# Altium schematic sheet Lidar_Robot_Power.SchDoc
size A
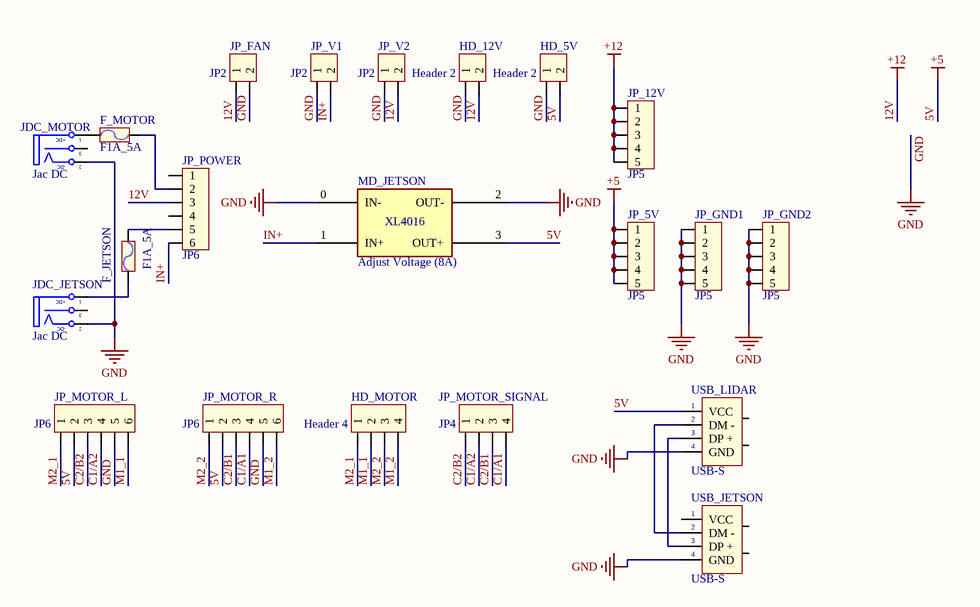
[diagram p0: Lidar_Robot_Power.SchDoc]

## Parts
F_JETSON  F1A_5A  [FUSE2]
F_MOTOR  F1A_5A  [FUSE2]
HD_5V  Header 2  [HED2]
HD_12V  Header 2  [HED2]
HD_MOTOR  Header 4  [HED4]
JDC_JETSON  Jac DC  [DC-IN]
JDC_MOTOR  Jac DC  [DC-IN]
JP_5V  JP5  [CON5]
JP_12V  JP5  [CON5]
JP_FAN  JP2  [CON2]
JP_GND1  JP5  [CON5]
JP_GND2  JP5  [CON5]
JP_MOTOR_L  JP6  [CON6]
JP_MOTOR_R  JP6  [CON6]
JP_MOTOR_SIGNAL  JP4  [CON4]
JP_POWER  JP6  [CON6]
JP_V1  JP2  [CON2]
JP_V2  JP2  [CON2]
MD_JETSON  Adjust Voltage (8A)  [XL4016]
USB_JETSON  USB-S  [USB-A]
USB_LIDAR  USB-S  [USB-A]

## Nets
5V: HD_5V.2 JP_5V.1 JP_5V.2 JP_5V.3 JP_5V.4 JP_5V.5 JP_MOTOR_L.2 JP_MOTOR_R.2 MD_JETSON.3(OUT+) USB_LIDAR.1(VCC)  [also labelled +5]
12V: HD_12V.2 JP_12V.1 JP_12V.2 JP_12V.3 JP_12V.4 JP_12V.5 JP_FAN.1 JP_POWER.3 JP_V2.2  [also labelled +12]
GND: HD_5V.1 HD_12V.1 JDC_JETSON.2(TN) JDC_MOTOR.2(TN) JP_FAN.2 JP_GND1.1 JP_GND1.2 JP_GND1.3 JP_GND1.4 JP_GND1.5 JP_GND2.1 JP_GND2.2 JP_GND2.3 JP_GND2.4 JP_GND2.5 JP_MOTOR_L.5 JP_MOTOR_R.5 JP_V1.1 JP_V2.1 MD_JETSON.0(IN-) MD_JETSON.2(OUT-) USB_JETSON.4(GND) USB_LIDAR.4(GND)
C1/A1: JP_MOTOR_R.4 JP_MOTOR_SIGNAL.4
C1/A2: JP_MOTOR_L.4 JP_MOTOR_SIGNAL.2
C2/B1: JP_MOTOR_R.3 JP_MOTOR_SIGNAL.3
C2/B2: JP_MOTOR_L.3 JP_MOTOR_SIGNAL.1
IN+: JP_POWER.6 JP_V1.2 MD_JETSON.1(IN+)
M1_1: HD_MOTOR.2 JP_MOTOR_L.6
M1_2: HD_MOTOR.4 JP_MOTOR_R.6
M2_1: HD_MOTOR.1 JP_MOTOR_L.1
M2_2: HD_MOTOR.3 JP_MOTOR_R.1
NetF_JETSON_1: F_JETSON.1 JDC_JETSON.1(T)
NetF_JETSON_2: F_JETSON.2 JP_POWER.5
NetF_MOTOR_1: F_MOTOR.1 JDC_MOTOR.1(T)
NetF_MOTOR_2: F_MOTOR.2 JP_POWER.2
NetUSB_JETSON_2: USB_JETSON.2(DM_-) USB_LIDAR.2(DM_-)
NetUSB_JETSON_3: USB_JETSON.3(DP_+) USB_LIDAR.3(DP_+)

Not connected (* = marked no-connect by the designer): JDC_JETSON 3(S); JDC_MOTOR 3(S); JP_POWER 1 4; USB_JETSON 1(VCC) 5 6; USB_LIDAR 5 6

## Notes on the sheet
- (in symbol DCIN) +DC; -DC

## Library data of the parts
F_JETSON F_MOTOR = Fuse: Designed by: VanDungEvn; Value: Fuse
HD_5V HD_12V = Hed2: Header 2 (Green); Value: Header 2
HD_MOTOR = Hed4: Header 4 (Green); Value: Header 4
JDC_JETSON JDC_MOTOR = DCIN: Jac DC input; Value: Jac DC
JP_5V JP_12V JP_GND1 JP_GND2 = Con5: Connector 5; Value: Connector 5
JP_FAN JP_V1 JP_V2 = Con2: Connector 2; Value: Connector 2
JP_MOTOR_L JP_MOTOR_R JP_POWER = Con6: Connector 6; Value: Connector 6
JP_MOTOR_SIGNAL = Con4: Connector 4; Value: Connector 4
MD_JETSON = XL4016
USB_JETSON USB_LIDAR = USB_S: USB connector; Value: USB